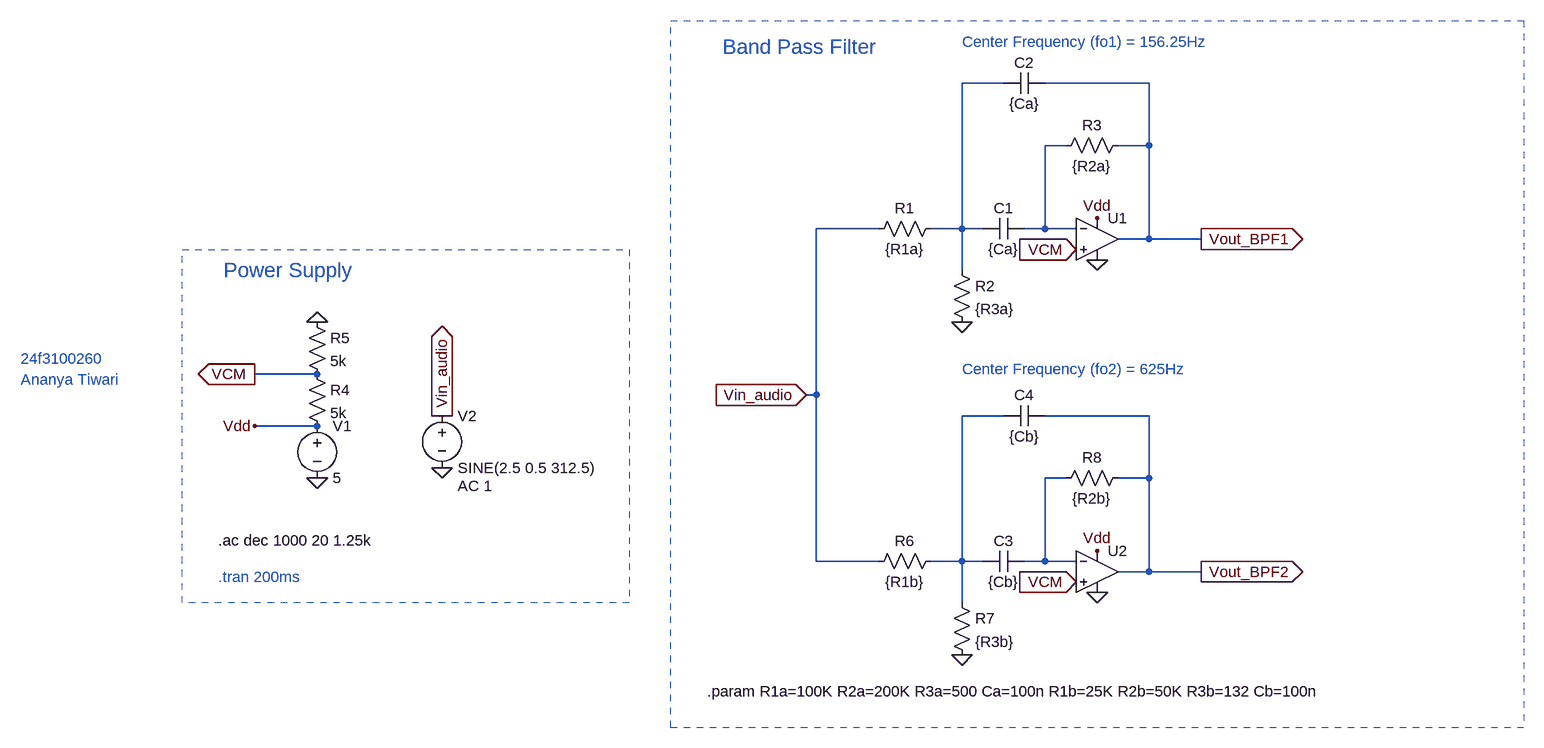
[diagram p0: schematic Analog 4.asc]
Analog 4.asc, the LTspice schematic file:
Version 4.1
SHEET 1 2340 840
WIRE 1152 -304 1088 -304
WIRE 1376 -304 1216 -304
WIRE 1248 -208 1216 -208
WIRE 1376 -208 1376 -304
WIRE 1376 -208 1328 -208
WIRE 960 -80 864 -80
WIRE 1088 -80 1088 -304
WIRE 1088 -80 1040 -80
WIRE 1120 -80 1088 -80
WIRE 1216 -80 1216 -208
WIRE 1216 -80 1184 -80
WIRE 1264 -80 1216 -80
WIRE 1376 -64 1376 -208
WIRE 1376 -64 1328 -64
WIRE 1456 -64 1376 -64
WIRE 1088 -16 1088 -80
WIRE 96 144 0 144
WIRE 864 176 864 -80
WIRE 864 176 848 176
WIRE 1152 208 1088 208
WIRE 1376 208 1216 208
WIRE 96 224 0 224
WIRE 1248 304 1216 304
WIRE 1376 304 1376 208
WIRE 1376 304 1328 304
WIRE 864 432 864 176
WIRE 960 432 864 432
WIRE 1088 432 1088 208
WIRE 1088 432 1040 432
WIRE 1120 432 1088 432
WIRE 1216 432 1216 304
WIRE 1216 432 1184 432
WIRE 1264 432 1216 432
WIRE 1376 448 1376 304
WIRE 1376 448 1328 448
WIRE 1456 448 1376 448
WIRE 1088 496 1088 432
FLAG 96 304 0
FLAG 96 64 0
FLAG 0 144 VCM
IOPIN 0 144 Out
FLAG 0 224 Vdd
FLAG 288 288 0
FLAG 288 208 Vin_audio
IOPIN 288 208 Out
FLAG 1296 -32 0
FLAG 1088 64 0
FLAG 1296 480 0
FLAG 1088 576 0
FLAG 1456 -64 Vout_BPF1
IOPIN 1456 -64 Out
FLAG 1456 448 Vout_BPF2
IOPIN 1456 448 Out
FLAG 848 176 Vin_audio
IOPIN 848 176 In
FLAG 1264 -48 VCM
IOPIN 1264 -48 In
FLAG 1264 464 VCM
IOPIN 1264 464 In
FLAG 1296 416 Vdd
FLAG 1296 -96 Vdd
SYMBOL res 1056 -96 R90
WINDOW 0 0 56 VBottom 2
WINDOW 3 32 56 VTop 2
SYMATTR InstName R1
SYMATTR Value {R1a}
SYMBOL res 1072 -32 R0
SYMATTR InstName R2
SYMATTR Value {R3a}
SYMBOL cap 1120 -96 M90
WINDOW 0 0 32 VBottom 2
WINDOW 3 32 32 VTop 2
SYMATTR InstName C1
SYMATTR Value {Ca}
SYMBOL cap 1152 -320 M90
WINDOW 0 0 32 VBottom 2
WINDOW 3 32 32 VTop 2
SYMATTR InstName C2
SYMATTR Value {Ca}
SYMBOL res 1344 -224 R90
WINDOW 0 0 56 VBottom 2
WINDOW 3 32 56 VTop 2
SYMATTR InstName R3
SYMATTR Value {R2a}
SYMBOL OpAmps\\UniversalOpAmp2 1296 -64 R0
SYMATTR InstName U1
SYMBOL voltage 96 208 R0
WINDOW 123 0 0 Left 0
WINDOW 39 0 0 Left 0
SYMATTR InstName V1
SYMATTR Value 5
SYMBOL res 80 128 R0
SYMATTR InstName R4
SYMATTR Value 5k
SYMBOL res 80 48 R0
SYMATTR InstName R5
SYMATTR Value 5k
SYMBOL res 1056 416 R90
WINDOW 0 0 56 VBottom 2
WINDOW 3 32 56 VTop 2
SYMATTR InstName R6
SYMATTR Value {R1b}
SYMBOL res 1072 480 R0
SYMATTR InstName R7
SYMATTR Value {R3b}
SYMBOL cap 1120 416 M90
WINDOW 0 0 32 VBottom 2
WINDOW 3 32 32 VTop 2
SYMATTR InstName C3
SYMATTR Value {Cb}
SYMBOL cap 1152 192 M90
WINDOW 0 0 32 VBottom 2
WINDOW 3 32 32 VTop 2
SYMATTR InstName C4
SYMATTR Value {Cb}
SYMBOL res 1344 288 R90
WINDOW 0 0 56 VBottom 2
WINDOW 3 32 56 VTop 2
SYMATTR InstName R8
SYMATTR Value {R2b}
SYMBOL OpAmps\\UniversalOpAmp2 1296 448 R0
SYMATTR InstName U2
SYMBOL voltage 288 192 R0
WINDOW 123 24 124 Left 2
WINDOW 39 0 0 Left 0
SYMATTR Value2 AC 1
SYMATTR InstName V2
SYMATTR Value SINE(2.5 0.5 312.5)
TEXT -360 120 Left 2 ;24f3100260
TEXT -360 152 Left 2 ;Ananya Tiwari
TEXT -56 400 Left 2 !.ac dec 1000 20 1.25k
TEXT -56 456 Left 2 ;.tran 200ms
TEXT -48 -16 Left 3 ;Power Supply
TEXT 720 -360 Left 3 ;Band Pass Filter
TEXT 1088 -368 Left 2 ;Center Frequency (fo1) = 156.25Hz
TEXT 1088 136 Left 2 ;Center Frequency (fo2) = 625Hz
TEXT 696 632 Left 2 !.param R1a=100K R2a=200K R3a=500 Ca=100n R1b=25K R2b=50K R3b=132 Cb=100n
RECTANGLE Normal 576 496 -112 -48 2
RECTANGLE Normal 1952 688 640 -400 2

The netlist it stands for:
* Analog 4.asc
R1 N001 Vin_audio {R1a}
R2 N001 0 {R3a}
C1 N001 N002 {Ca}
C2 N001 Vout_BPF1 {Ca}
R3 Vout_BPF1 N002 {R2a}
X§U1 VCM N002 Vdd 0 Vout_BPF1 level2 Avol=1Meg GBW=10Meg Slew=10Meg Ilimit=25m Rail=0 Vos=0 En=0 Enk=0 In=0 Ink=0 Rin=500Meg  ; pins In+ In- V+ V- OUT
V1 Vdd 0 5
R4 VCM Vdd 5k
R5 0 VCM 5k
R6 N003 Vin_audio {R1b}
R7 N003 0 {R3b}
C3 N003 N004 {Cb}
C4 N003 Vout_BPF2 {Cb}
R8 Vout_BPF2 N004 {R2b}
X§U2 VCM N004 Vdd 0 Vout_BPF2 level2 Avol=1Meg GBW=10Meg Slew=10Meg Ilimit=25m Rail=0 Vos=0 En=0 Enk=0 In=0 Ink=0 Rin=500Meg  ; pins In+ In- V+ V- OUT
V2 Vin_audio 0 SINE(2.5 0.5 312.5) AC 1
* 24f3100260
* Ananya Tiwari
.ac dec 1000 20 1.25k
* .tran 200ms
* Power Supply
* Band Pass Filter
* Center Frequency (fo1) = 156.25Hz
* Center Frequency (fo2) = 625Hz
.param R1a=100K R2a=200K R3a=500 Ca=100n R1b=25K R2b=50K R3b=132 Cb=100n
.lib UniversalOpAmp2.lib
.backanno
.end